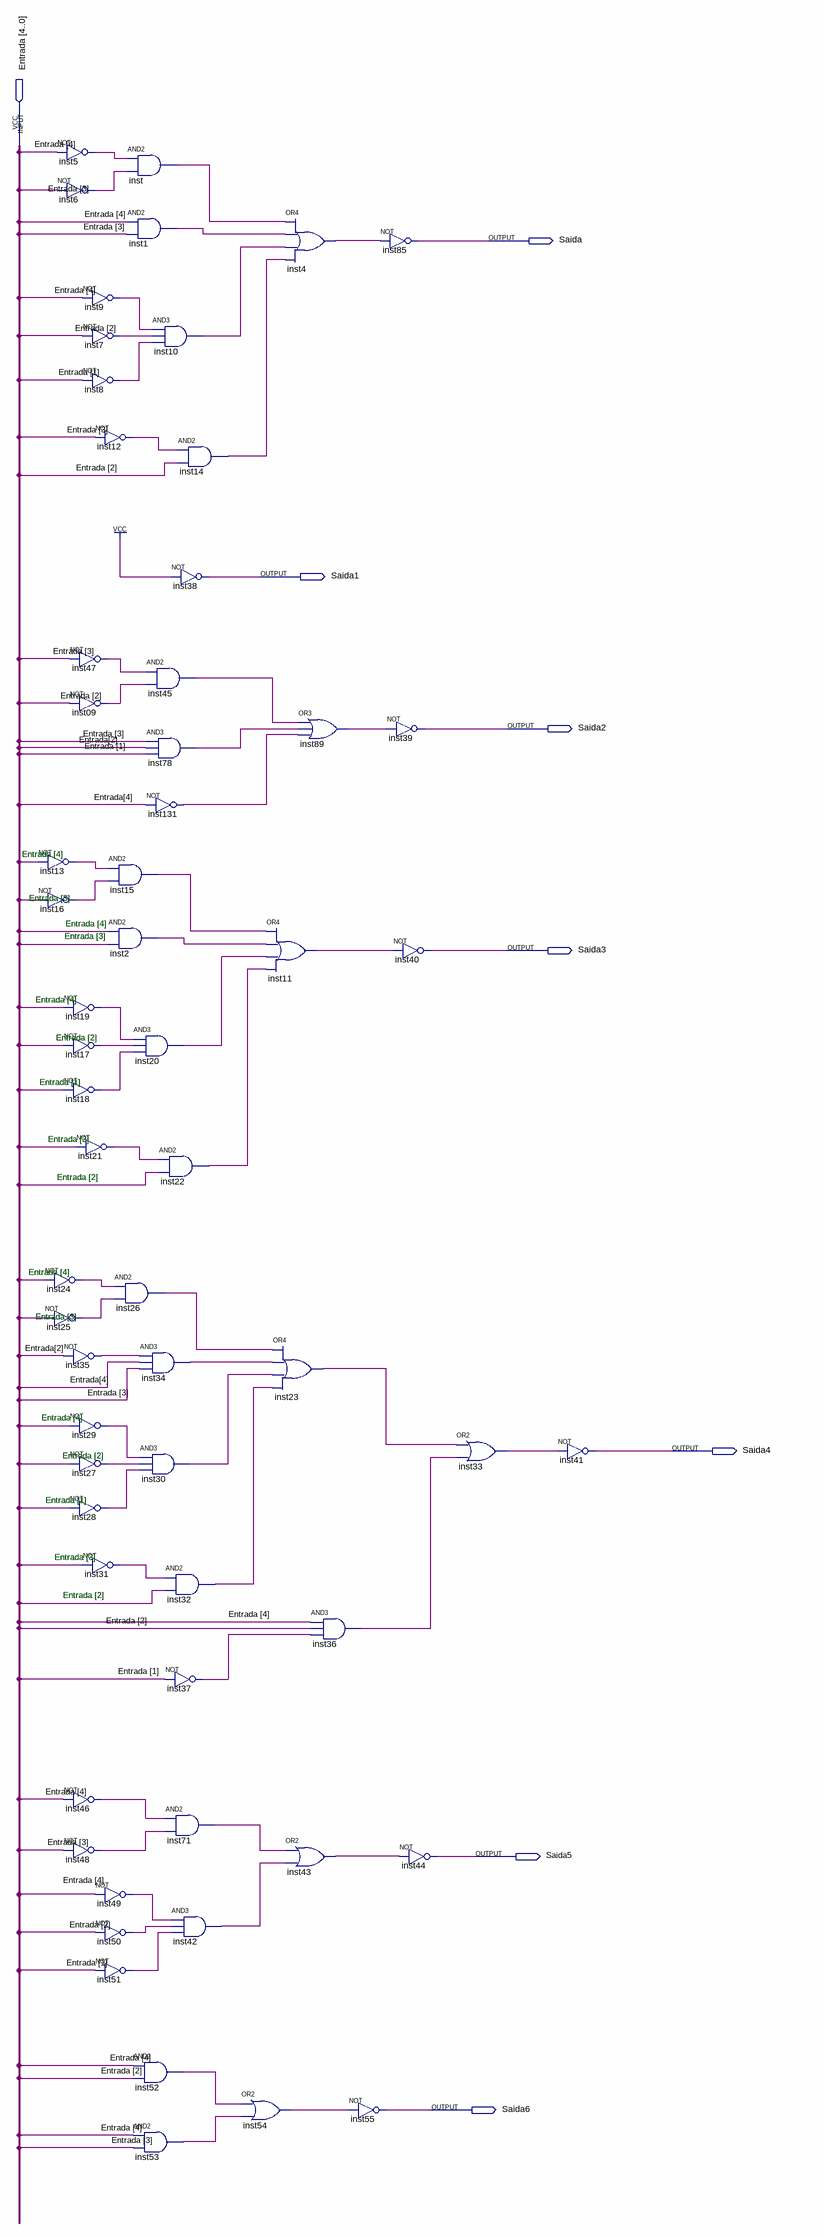
[diagram p0: schematic sheet]
// Quartus schematic DisplayDezena.bdf as structural Verilog: 61 symbols, 8 pins
module DisplayDezena (
  input  [4:0] Entrada,
  output Saida,
  output Saida1,
  output Saida2,
  output Saida3,
  output Saida4,
  output Saida5,
  output Saida6
);

  wire inst1_out, inst2_out, inst4_out, inst5_out, inst6_out, inst7_out, inst8_out, inst9_out, inst09_out,
       inst10_out, inst11_out, inst12_out, inst13_out, inst14_out, inst15_out, inst16_out, inst17_out,
       inst18_out, inst19_out, inst20_out, inst21_out, inst22_out, inst23_out, inst24_out, inst25_out,
       inst26_out, inst27_out, inst28_out, inst29_out, inst30_out, inst31_out, inst32_out, inst33_out,
       inst34_out, inst35_out, inst36_out, inst37_out, inst42_out, inst43_out, inst45_out, inst46_out,
       inst47_out, inst48_out, inst49_out, inst50_out, inst51_out, inst52_out, inst53_out, inst54_out,
       inst71_out, inst78_out, inst89_out, inst131_out, inst_out;

  not inst13 (inst13_out, Entrada[4]);
  not inst16 (inst16_out, Entrada[3]);
  not inst24 (inst24_out, Entrada[4]);
  not inst25 (inst25_out, Entrada[3]);
  not inst5 (inst5_out, Entrada[4]);
  not inst6 (inst6_out, Entrada[3]);
  not inst9 (inst9_out, Entrada[4]);
  not inst7 (inst7_out, Entrada[2]);
  not inst8 (inst8_out, Entrada[1]);
  not inst12 (inst12_out, Entrada[3]);
  not inst47 (inst47_out, Entrada[3]);
  not inst09 (inst09_out, Entrada[2]);
  not inst19 (inst19_out, Entrada[4]);
  not inst17 (inst17_out, Entrada[2]);
  not inst18 (inst18_out, Entrada[1]);
  not inst21 (inst21_out, Entrada[3]);
  not inst35 (inst35_out, Entrada[2]);
  not inst29 (inst29_out, Entrada[4]);
  not inst27 (inst27_out, Entrada[2]);
  not inst28 (inst28_out, Entrada[1]);
  not inst31 (inst31_out, Entrada[3]);
  not inst46 (inst46_out, Entrada[4]);
  not inst48 (inst48_out, Entrada[3]);
  not inst49 (inst49_out, Entrada[4]);
  not inst50 (inst50_out, Entrada[2]);
  not inst51 (inst51_out, Entrada[1]);
  and inst (inst_out, inst5_out, inst6_out);
  and inst1 (inst1_out, Entrada[4], Entrada[3]);
  and inst10 (inst10_out, inst9_out, inst7_out, inst8_out);
  and inst45 (inst45_out, inst47_out, inst09_out);
  and inst78 (inst78_out, Entrada[3], Entrada[2], Entrada[1]);
  not inst131 (inst131_out, Entrada[4]);
  and inst15 (inst15_out, inst13_out, inst16_out);
  and inst2 (inst2_out, Entrada[4], Entrada[3]);
  and inst20 (inst20_out, inst19_out, inst17_out, inst18_out);
  and inst26 (inst26_out, inst24_out, inst25_out);
  and inst34 (inst34_out, inst35_out, Entrada[4], Entrada[3]);
  and inst30 (inst30_out, inst29_out, inst27_out, inst28_out);
  and inst52 (inst52_out, Entrada[4], Entrada[2]);
  and inst53 (inst53_out, Entrada[4], Entrada[3]);
  and inst14 (inst14_out, inst12_out, Entrada[2]);
  not inst38 (Saida1, 1'b1);
  and inst22 (inst22_out, inst21_out, Entrada[2]);
  and inst32 (inst32_out, inst31_out, Entrada[2]);
  not inst37 (inst37_out, Entrada[1]);
  and inst71 (inst71_out, inst46_out, inst48_out);
  and inst42 (inst42_out, inst49_out, inst50_out, inst51_out);
  or inst54 (inst54_out, inst52_out, inst53_out);
  or inst4 (inst4_out, inst_out, inst1_out, inst10_out, inst14_out);
  or inst89 (inst89_out, inst45_out, inst78_out, inst131_out);
  or inst11 (inst11_out, inst15_out, inst2_out, inst20_out, inst22_out);
  or inst23 (inst23_out, inst26_out, inst34_out, inst30_out, inst32_out);
  or inst43 (inst43_out, inst71_out, inst42_out);
  and inst36 (inst36_out, Entrada[4], Entrada[2], inst37_out);
  not inst55 (Saida6, inst54_out);
  not inst85 (Saida, inst4_out);
  not inst39 (Saida2, inst89_out);
  not inst40 (Saida3, inst11_out);
  not inst44 (Saida5, inst43_out);
  or inst33 (inst33_out, inst23_out, inst36_out);
  not inst41 (Saida4, inst33_out);

  // Notes on the sheet:
  //   Entrada [4]
  //   Entrada [3]
  //   Entrada [4]
  //   Entrada [3]
  //   Entrada [4]
  //   Entrada [2]
  //   Entrada [1]
  //   Entrada [3]
  //   Entrada [2]
  //   Entrada [4]
  //   Entrada [3]
  //   Entrada [4]
  //   Entrada [2]
  //   Entrada [1]
  //   Entrada [3]
  //   Entrada [2]
endmodule
